# EAGLE design Color Detector RPi Board (EAGLE 9.1.3)
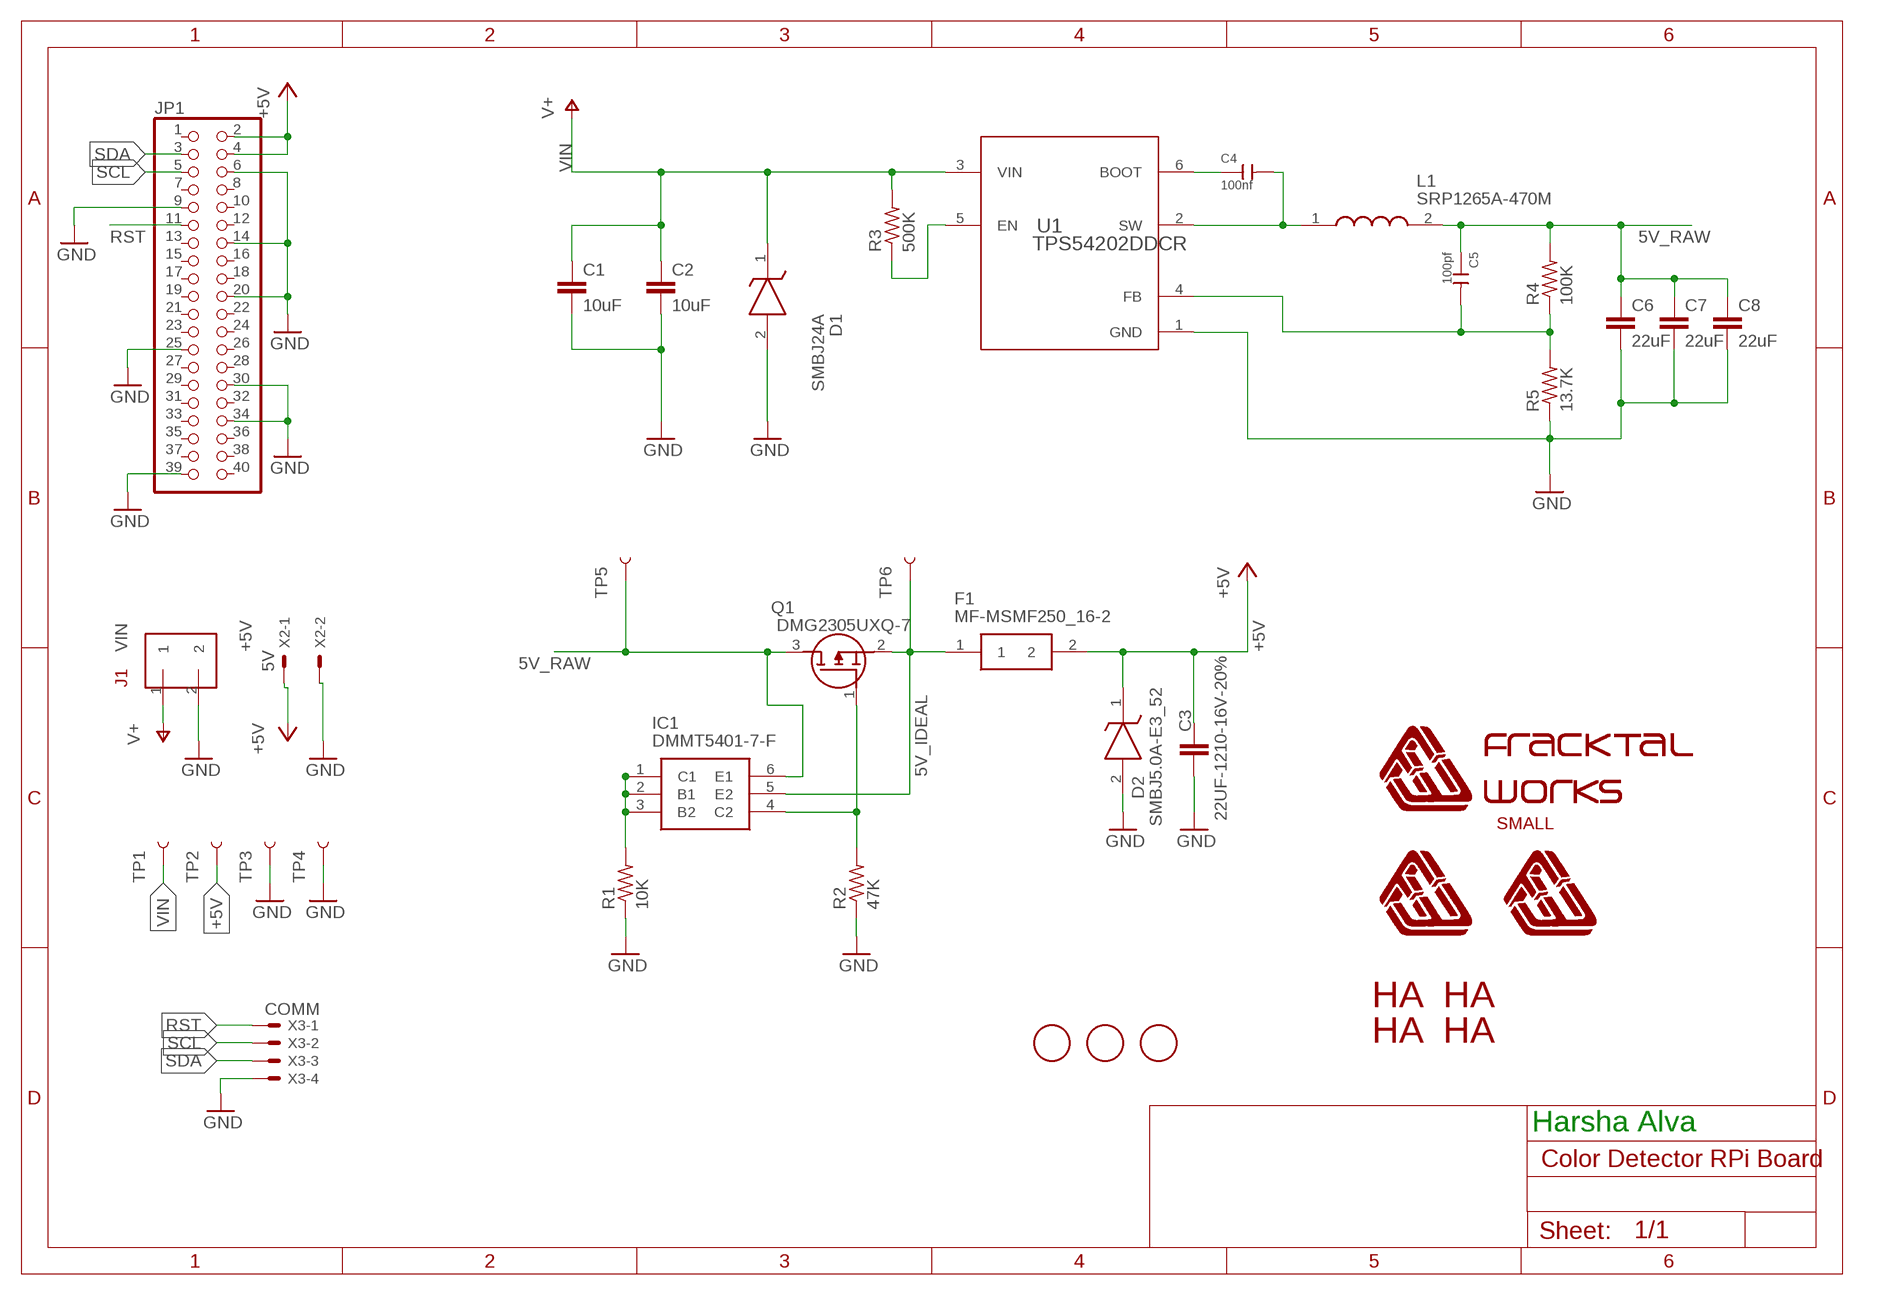
[diagram p0: schematic, sheet 1]

## Parts
$1_39_$_2020-06-29_16-08-13  HA_MARK  [HA_MARK]
$1_40_$_2020-06-29_16-08-1  HA_MARK  [HA_MARK]
$1_40_$_2020-06-29_16-08-13  HA_MARK  [HA_MARK]
C1  10uF  10UF-1210-50V-20%  [1210]
C2  10uF  10UF-1210-50V-20%  [1210]
C3  22UF-1210-16V-20%  [1210]
C4  100nf  CERAMIC-100NF-50V-10%-X7R(0603)  [C0603]
C5  100pf  CERAMIC-100PF-50V-5%-NPO(0603)  [C0603]
C6  22uF  22UF-1210-16V-20%  [1210]
C7  22uF  22UF-1210-16V-20%  [1210]
C8  22uF  22UF-1210-16V-20%  [1210]
D1  SMBJ24A  [DIOM5436X244N]
D2  SMBJ5.0A-E3_52  [DIOM5436X244N]
F1  MF-MSMF250_16-2  [FUSC4632X160N]
FW_TXT_S_2  FWLOGO_TEXT_SMALL  [FWLOGO_TEXT_SMALL]
FWLOGO_1  FWLOGO  [FWLOGO]
FWLOGO_2  FWLOGO  [FWLOGO]
IC1  DMMT5401-7-F  [SOT95P275X110-6N]
J1  TERMINALBLOCK/TOYO/2PIN/5MMPITCH  [TERMINALBLOCK/TOYO/2PIN/5MMPITCH]
JP1  RASPBERRYPI_3B_GPIO  [RASPBERRYPI_3B_GPIO]
L1  SRP1265A-470M  [SRP1265A]
M_HA_1  HA_MARK  [HA_MARK]
Q1  DMG2305UXQ-7  [SOT96P240X110-3N]
R1  10K  R-US_M0805  [M0805]
R2  47K  R-US_M0805  [M0805]
R3  500K  R-US_R0603  [R0603]
R4  100K  R-US_R0603  [R0603]
R5  13.7K  R-US_R0603  [R0603]
TP1  TEST-POINT3X5  [PAD.03X.05]
TP2  TEST-POINT3X5  [PAD.03X.05]
TP3  TEST-POINT3X5  [PAD.03X.05]
TP4  TEST-POINT3X5  [PAD.03X.05]
TP5  TEST-POINT3X5  [PAD.03X.05]
TP6  TEST-POINT3X5  [PAD.03X.05]
U1  TPS54202DDCR  [DDC0006A_N]
U$1  FIDUCIAL  [FIDUCIAL_1MM]
U$2  FIDUCIAL  [FIDUCIAL_1MM]
U$3  FIDUCIAL  [FIDUCIAL_1MM]
X2  5V  JST-XH-02-PIN-LONG-PAD  [JST-XH-02-PACKAGE-LONG-PAD]
X3  COMM  JST-XH-04-PIN-ROUND-PAD  [JST-XH-04-PACKAGE-ROUND-PAD]

## Nets
5V_IDEAL: F1.1 IC1.5(E2) Q1.2(S) TP6.P$1
5V_RAW: C5.1 C6.1 C7.1 C8.1 IC1.6(E1) L1.2 Q1.3(D) R4.2 TP5.P$1
+5V: C3.2 D2.1(K) F1.2 JP1.2 JP1.4 TP2.P$1 X2.1
GND: C1.2 C2.2 C3.1 C6.2 C7.2 C8.2 D1.2(A) D2.2(A) J1.2 JP1.6 JP1.9 JP1.14 JP1.20 JP1.25 JP1.30 JP1.34 JP1.39 R1.1 R2.1 R5.1 TP3.P$1 TP4.P$1 U1.1(GND) X2.2 X3.4
N$1: IC1.4(C2) Q1.1(G) R2.2
N$2: IC1.1(C1) IC1.2(B1) IC1.3(B2) R1.2
N$5: R3.1 U1.5(EN)
N$7: C5.2 R4.1 R5.2 U1.4(FB)
N$18: C4.2 L1.1 U1.2(SW)
N$20: C4.1 U1.6(BOOT)
RST: JP1.11 X3.1
SCL: JP1.5 X3.2
SDA: JP1.3 X3.3
VIN: C1.1 C2.1 D1.1(K) J1.1 R3.2 TP1.P$1 U1.3(VIN) ; supply symbol labelled V+
Unconnected: JP1.1 JP1.7 JP1.8 JP1.10 JP1.12 JP1.13 JP1.15 JP1.16 JP1.17 JP1.18 JP1.19 JP1.21 JP1.22 JP1.23 JP1.24 JP1.26 JP1.27 JP1.28 JP1.29 JP1.31 JP1.32 JP1.33 JP1.35 JP1.36 JP1.37 JP1.38 JP1.40

## Notes on the sheet
- Harsha Alva

## Library data of the parts
$1_39_$_2020-06-29_16-08-13 $1_40_$_2020-06-29_16-08-1 $1_40_$_2020-06-29_16-08-13 M_HA_1 = FracktalWorks:HA_MARK: Maker mark
C1 C2 = SparkFun-Capacitors:10UF: 10.0µF ceramic capacitors A capacitor is a passive two-terminal electrical component used to store electrical energy temporarily in an electric field.; PROD_ID: CAP-09824
C3 C6-C8 = SparkFun-Capacitors:22UF: 22µF ceramic capacitors A capacitor is a passive two-terminal electrical component used to store electrical energy temporarily in an electric field.
C4 = Seeed-Capacitor:CERAMIC-100NF-50V-10%-X7R(0603): 302010138; MPN: CC0603KRX7R9BB104
C5 = Seeed-Capacitor:CERAMIC-100PF-50V-5%-NPO(0603): 302010076; MPN: CC0603JRNPO9BN101
D1 = SamacSys_Parts:SMBJ24A: Bourns SMBJ24A, Uni-Directional TVS Diode, 600W, 2-Pin DO-214AA Source: Datasheet <https://www.bourns.com/docs/Product-Datasheets/SMBJ.pdf>; DESCRIPTION: Bourns SMBJ24A, Uni-Directional TVS Diode, 600W, 2-Pin DO-214AA; HEIGHT: 2.44mm; MANUFACTURER_NAME: Bourns; MANUFACTURER_PART_NUMBER: SMBJ24A; MOUSER_PART_NUMBER: 652-SMBJ24A; MOUSER_PRICE-STOCK: https://www.mouser.co.uk/ProductDetail/Bourns/SMBJ24A?qs=%252Bf8Cd6aE5bw8ORwlx6vP0Q%3D%3D
D2 = SamacSys_Parts:SMBJ5.0A-E3_52: Vishay SMBJ5.0A-E3/52, Uni-Directional TVS Diode, 600W, 2-Pin DO-214AA Source: Datasheet <https://www.vishay.com/docs/88392/smbj.pdf>; ALLIED_NUMBER: 70217303; ALLIED_PRICE-STOCK: https://www.alliedelec.com/generalsemiconductor-vishay-smbj5-0a-e3-52/70217303/; DESCRIPTION: Vishay SMBJ5.0A-E3/52, Uni-Directional TVS Diode, 600W, 2-Pin DO-214AA; HEIGHT: 2.44mm; MANUFACTURER_NAME: Vishay; MANUFACTURER_PART_NUMBER: SMBJ5.0A-E3/52; MOUSER_PART_NUMBER: 625-SMBJ5.0A-E3; MOUSER_PRICE-STOCK: https://www.mouser.com/Search/Refine.aspx?Keyword=625-SMBJ5.0A-E3; RS_PART_NUMBER: 1652507; RS_PRICE-STOCK: http://uk.rs-online.com/web/p/products/1652507
F1 = SamacSys_Parts:MF-MSMF250_16-2: BOURNS - MF-MSMF250/16-2 - FUSE, RESETTABLE PTC, 16V, 2.5A, 1812 Source: Datasheet <https://www.bourns.com/pdfs/mfmsmf.pdf>; DESCRIPTION: BOURNS - MF-MSMF250/16-2 - FUSE, RESETTABLE PTC, 16V, 2.5A, 1812; HEIGHT: 1.6mm; MANUFACTURER_NAME: Bourns; MANUFACTURER_PART_NUMBER: MF-MSMF250/16-2; MOUSER_PART_NUMBER: 652-MF-MSMF250/16-2; MOUSER_PRICE-STOCK: https://www.mouser.com/Search/Refine.aspx?Keyword=652-MF-MSMF250%2F16-2; RS_PART_NUMBER: 6478229P; RS_PRICE-STOCK: http://uk.rs-online.com/web/p/products/6478229P
FW_TXT_S_2 = FracktalWorks:FWLOGO_TEXT_SMALL
FWLOGO_1 FWLOGO_2 = FracktalWorks:FWLOGO: Fracktal Works Logo without name
IC1 = SamacSys_Parts:DMMT5401-7-F: Transistor Dual PNP 150V 0.2A SOT26-6 Diodes Inc DMMT5401-7-F Dual PNP Bipolar Transistor, -200 mA, -150 V, 6-Pin SOT-26 Source: Datasheet; DESCRIPTION: Transistor Dual PNP 150V 0.2A SOT26-6 Diodes Inc DMMT5401-7-F Dual PNP Bipolar Transistor, -200 mA, -150 V, 6-Pin SOT-26; HEIGHT: 1.1mm; MANUFACTURER_NAME: Diodes Inc.; MANUFACTURER_PART_NUMBER: DMMT5401-7-F; MOUSER_PART_NUMBER: 621-DMMT5401-7-F; MOUSER_PRICE-STOCK: https://www.mouser.co.uk/ProductDetail/Diodes-Incorporated/DMMT5401-7-F?qs=hiZRsJxw0h3f7LzTPwvEFQ%3D%3D
J1 = FracktalWorks:TERMINALBLOCK/TOYO/2PIN/5MMPITCH
JP1 = FracktalWorks:RASPBERRYPI_3B_GPIO
L1 = SamacSys_Parts:SRP1265A-470M: Bourns SRP1265A Series Shielded Wire-wound SMD Inductor with a Carbonyl Powder Core, 47 uH 20% 6.5A Idc Source: Datasheet <https://www.bourns.com/docs/Product-Datasheets/SRP1265A.pdf>; DESCRIPTION: Bourns SRP1265A Series Shielded Wire-wound SMD Inductor with a Carbonyl Powder Core, 47 uH 20% 6.5A Idc; HEIGHT: mm; MANUFACTURER_NAME: Bourns; MANUFACTURER_PART_NUMBER: SRP1265A-470M; MOUSER_PART_NUMBER: 652-SRP1265A-470M; MOUSER_PRICE-STOCK: https://www.mouser.com/Search/Refine.aspx?Keyword=652-SRP1265A-470M; RS_PART_NUMBER: 8193513P; RS_PRICE-STOCK: http://uk.rs-online.com/web/p/products/8193513P
Q1 = SamacSys_Parts:DMG2305UXQ-7: MOSFET MOSFET BVDSS Source: Datasheet <https://componentsearchengine.com/Datasheets/1/DMG2305UXQ-7.pdf>; DESCRIPTION: MOSFET MOSFET BVDSS; HEIGHT: 1.1mm; MANUFACTURER_NAME: Diodes Inc.; MANUFACTURER_PART_NUMBER: DMG2305UXQ-7; MOUSER_PART_NUMBER: 621-DMG2305UXQ-7; MOUSER_PRICE-STOCK: https://www.mouser.co.uk/ProductDetail/Diodes-Incorporated/DMG2305UXQ-7?qs=60RJRzIpcl%2FUiAojHt1c9w%3D%3D
R1 R2 = resistor:R-US_: RESISTOR, American symbol
R3-R5 = adafruit:R-US_: RESISTOR, American symbol
TP1-TP6 = SparkFun-Connectors:TEST-POINT: SparkFun Test Points Bare copper test points for troubleshooting or In-Circuit-Testing. These are used by our Production team for verifying production board runs using pogo-pins on test beds. SparkFun Products: SparkFun LSM9DS1 Breakout <https://www.sparkfun.com/products/13284> SparkFun PSOC <https://www.sparkfun.com/products/13714> SparkFun Load Cell Amplifier <https://www.sparkfun.com/products/13879>
U1 = AlainElements:TPS54202DDCR; ALTERNATEPARTNUMBER: TPS54202DDCT; APPLICATION_BUILDNUMBER: *; COMPTYPE: IC; MANUFACTURER: Texas Instruments; MANUFACTURER_NAME: Texas Instruments; MANUFACTURER_PART_NUMBER: TPS54202DDCR; MOUNTTYPE: SMT; PACKAGEREFERENCE: DDC0006A; PARTNUMBER: TPS54202DDCR; PIN_COUNT: 6; REFDES: RefDes; ROHS: Y; TYPE: TYPE; VALUE: Value
U$1-U$3 = adafruit:FIDUCIAL: For use by pick and place machines to calibrate the vision/machine, 1mm By microbuilder.eu
X2 = Rembrandt Electronics - JST XH Connectors v1-0:JST-XH-02-PIN: JST XH Connector 2 Pin Wire to board connector. Pitch: 2,54 mm, (0.100") Number of pins: 2 Created by Rembrandt Electronics www.rembrandtelectronics.com
X3 = Rembrandt:JST-XH-04-PIN: JST XH Connector 2 Pin Wire to board connector. Pitch: 2,54 mm, (0.100") Number of pins: 4 Created by Rembrandt Electronics www.rembrandtelectronics.com

## Board
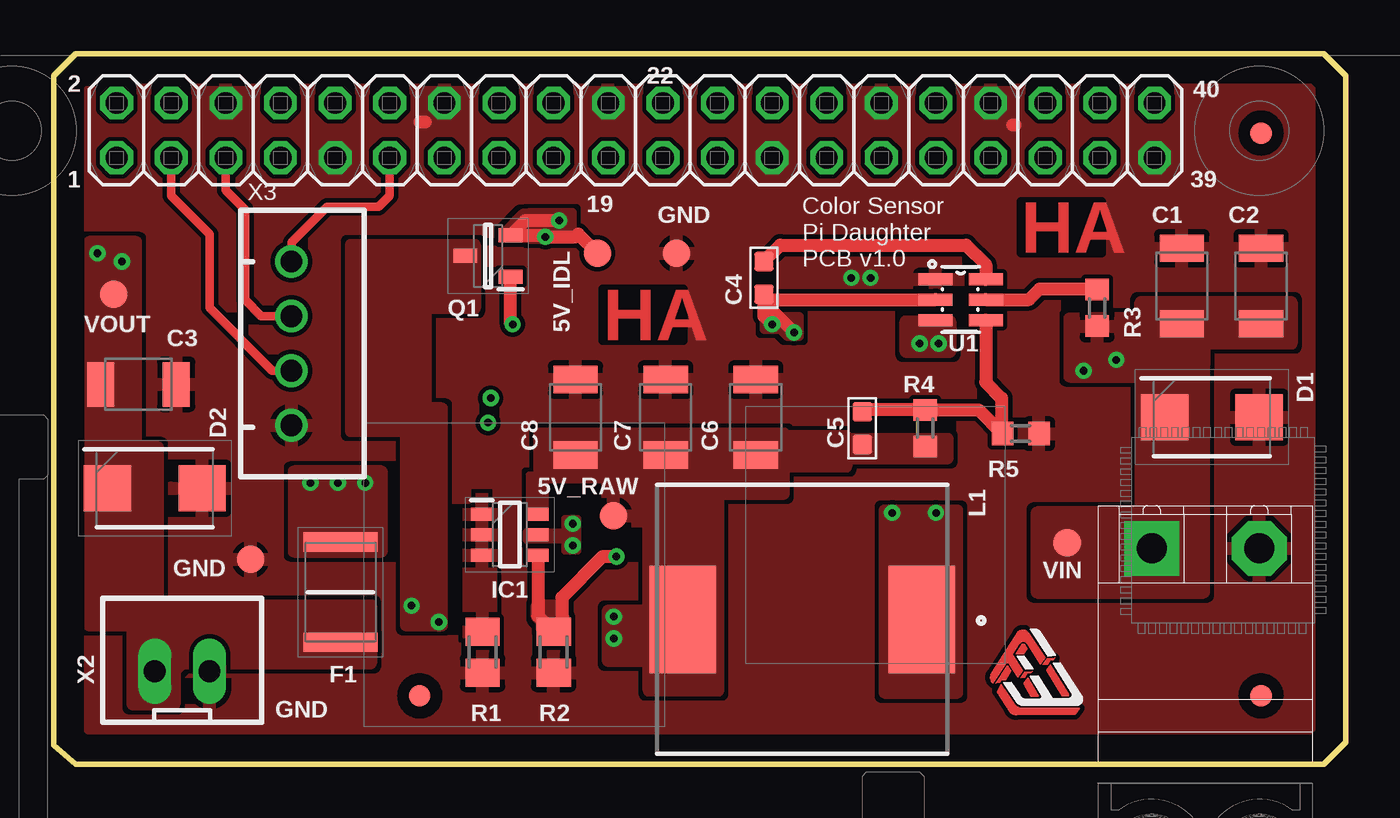
[diagram p1: board, top side]
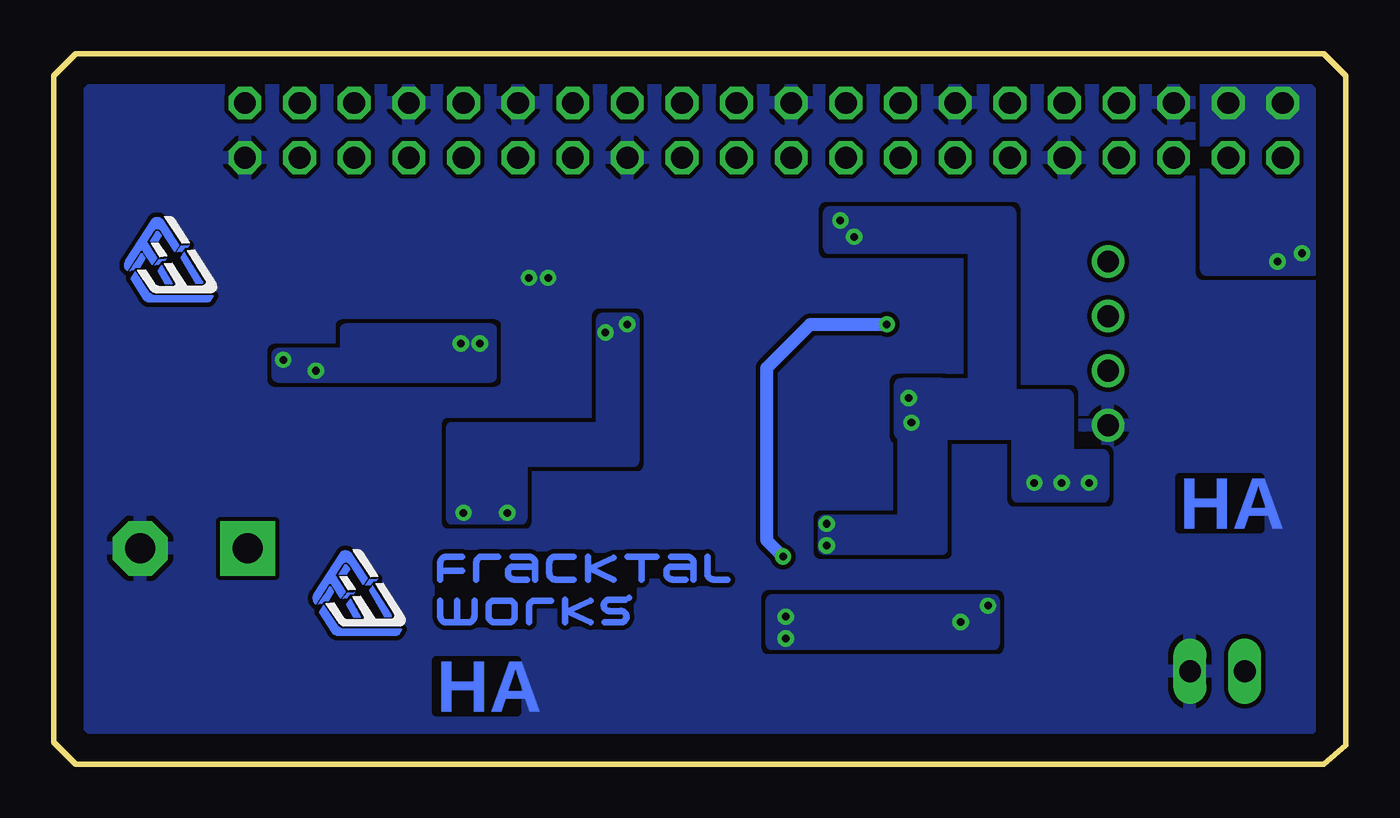
[diagram p2: board, bottom side, seen from below]

Size 60.07 x 33.02 mm. Coordinates in mm from the lower left corner, seen from the top.
Outline: 0,32 0,0.89 1.02,0 59.05,0 60.07,1.02 60.07,32 59.05,33.02 1.02,33.02 0,32
Copper layers (1*16): Top 0.035mm / dielectric 1.5mm / Bottom 0.035mm
Design rules "LionCircuits": minimum track width 8mil, minimum drill 0.35mm, track to track 8mil, track to pad 8mil, pad to pad 8mil, via to via 8mil, smd to smd 8mil, copper to edge 50mil, drill to drill 10mil, minimum pad ring 10mil, minimum via ring 8mil, stop-mask expansion 4mil, vias tented up to drill 0mil, thermal gap 10mil

### Footprints (pad centres in the part's own frame; a part is rotated, then mirrored left to right if it is on the bottom)
1210 = smd 1.27 x 2.06: 1 -1.755,0; 2 1.755,0
C0603 = smd 0.889 x 0.889: 1 0,0.762; 2 0,-0.762
DIOM5436X244N = smd 2.2 x 2.15: 1 -2.2,0; 2 2.2,0
FUSC4632X160N = smd 0.89 x 3.43: 1 -2.325,0; 2 2.325,0
SOT95P275X110-6N = smd 1 x 0.6: 1 -1.3,0.95; 2 -1.3,0; 3 -1.3,-0.95; 4 1.3,-0.95; 5 1.3,0; 6 1.3,0.95
TERMINALBLOCK/TOYO/2PIN/5MMPITCH = drill 1.4 pad 2.54 square: 1 0,0 | drill 1.4 pad 2.54 octagon: 2 5,0
RASPBERRYPI_3B_GPIO = drill 1.016 octagon: 1 -24.13,-1.27; 2 -24.13,1.27; 3 -21.59,-1.27; 4 -21.59,1.27; 5 -19.05,-1.27; 6 -19.05,1.27; 7 -16.51,-1.27; 8 -16.51,1.27; 9 -13.97,-1.27; 10 -13.97,1.27; 11 -11.43,-1.27; 12 -11.43,1.27; 13 -8.89,-1.27; 14 -8.89,1.27; 15 -6.35,-1.27; 16 -6.35,1.27; 17 -3.81,-1.27; 18 -3.81,1.27; 19 -1.27,-1.27; 20 -1.27,1.27; 21 1.27,-1.27; 22 1.27,1.27; 23 3.81,-1.27; 24 3.81,1.27; 25 6.35,-1.27; 26 6.35,1.27; 27 8.89,-1.27; 28 8.89,1.27; 29 11.43,-1.27; 30 11.43,1.27; 31 13.97,-1.27; 32 13.97,1.27; 33 16.51,-1.27; 34 16.51,1.27; 35 19.05,-1.27; 36 19.05,1.27; 37 21.59,-1.27; 38 21.59,1.27; 39 24.13,-1.27; 40 24.13,1.27
SRP1265A = smd 3.1 x 5: 1 -5.55,0; 2 5.55,0
SOT96P240X110-3N = smd 1.1 x 0.65: 1 -1.05,0.96; 2 -1.05,-0.96; 3 1.05,0
M0805 = smd 1.3 x 1.6: 1 -0.95,0; 2 0.95,0
R0603 = smd 1 x 1.1: 1 -0.85,0; 2 0.85,0
PAD.03X.05 = smd 1.27 x 1.27: P$1 0,0
DDC0006A_N = smd 1.575 x 0.559: 1 -1.168,0.95; 2 -1.168,0; 3 -1.168,-0.95; 4 1.168,-0.95; 5 1.168,0; 6 1.168,0.95
FIDUCIAL_1MM = smd 1 x 1: 1 0,0
JST-XH-02-PACKAGE-LONG-PAD = drill 1.016 long: 1 -1.27,0; 2 1.27,0
JST-XH-04-PACKAGE-ROUND-PAD = drill 1.016: 1 -3.81,0; 2 -1.27,0; 3 1.27,0; 4 3.81,0

### Placement (x,y rotation side)
$1_39_$_2020-06-29_16-08-13  42.29,2.41 0 bottom
$1_40_$_2020-06-29_16-08-1  44.96,23.75 0 top
$1_40_$_2020-06-29_16-08-13  7.75,10.92 0 bottom
C1  52.45,22.23 90 top
C2  56.13,22.23 90 top
C3  3.94,17.65 180 top
C4  33.02,22.61 0 top
C5  37.59,15.62 180 top
C6  32.64,16.13 90 top
C7  28.45,16.13 90 top
C8  24.26,16.13 90 top
D1  53.85,16.13 0 top
D2  4.7,12.83 0 top
F1  13.34,8 270 top
FW_TXT_S_2  48.26,4.83 0 bottom
FWLOGO_1  42.04,1.14 0 top
FWLOGO_2  58.29,20.32 0 bottom
IC1  21.21,10.67 0 top
J1  51.05,10.03 0 top
JP1  27.05,29.46 0 top
L1  34.8,6.73 180 top
M_HA_1  25.53,19.69 0 top
Q1  20.19,23.62 180 top
R1  19.94,5.21 90 top
R2  23.24,5.21 90 top
R3  48.51,21.21 270 top
R4  40.51,15.62 270 top
R5  44.96,15.37 180 top
TP1  47.12,10.29 0 top
TP2  2.79,21.84 0 top
TP3  28.96,23.75 0 top
TP4  9.14,9.52 0 top
TP5  26.04,11.56 0 top
TP6  25.27,23.75 0 top
U1  42.16,21.59 0 top
U$1  17.02,3.17 0 top
U$2  56.13,29.34 0 top
U$3  56.13,3.17 0 top
X2  5.97,4.32 0 top
X3  11.05,19.56 270 top

### Tracks (layer width: path | path; a pad name or v marks a point on that pad's centre or on a via)
5V_IDEAL  (via drill 0.35)
  Top 0.61: TP6.P$1 24.38,24.64 24.26,24.51 v22.86,24.51 22.79,24.58 22.1,24.58 Q1.2 21.93,25.27 v23.5,25.27
  other vias: 20.19,15.87 20.32,17.02 11.94,13.08 13.21,13.08 14.48,13.08 24.13,11.18 24.13,10.16
  pour Bottom: 11.3,12.45 15.24,12.45 15.24,15.37 20.7,15.37 20.7,17.65 17.27,17.65 17.27,24 17.4,24 24,24 24,25.65 15.62,25.65 15.62,17.14 12.95,17.14 12.95,14.35 11.3,14.35
  pour Top (no thermals): 11.18,9.91 15.24,9.91 15.24,13.59 11.18,13.59
  pour Bottom: 24.26,11.3 24.26,10.03 18.8,10.03 18.8,17.65 20.57,17.65 20.57,11.3
  pour Top (no thermals): 21.97,10.79 23.75,10.79 23.75,11.43 24.38,11.43 24.38,9.91 23.75,9.91 23.75,10.41 21.97,10.41
  pour Top: 22.1,25.65 24.13,25.65 24.13,24.38 22.1,24.38
  pour Top (no thermals): 22.23,24.51 20.95,24.51 20.95,24.64 21.84,25.53 22.23,25.53
5V_RAW  (via drill 0.35)
  other vias: 26.04,6.86 26.04,5.84 16.64,7.37 17.91,6.6
  pour Top (no thermals): 22.61,15.37 33.91,15.37 33.91,12.57 30.86,12.57 30.86,3.43 27.69,3.43 27.69,13.33 22.61,13.33
  pour Top (no thermals): 19.56,24.13 19.56,21.21 17.27,21.21 17.27,15.49 13.84,15.49 13.84,24.13
  pour Top: 16.38,16.51 16.38,6.48 18.03,6.48 18.03,16.51
  pour Bottom: 26.67,7.62 16.38,7.62 16.38,5.59 26.67,5.59
  pour Top: 25.78,7.11 25.78,4.83 28.19,4.83 28.19,7.11
  pour Top (no thermals): 22.1,13.46 22.1,11.56 22.86,11.56 22.86,13.46
  pour Top (no thermals): 36.7,15.11 41.53,15.11 41.53,14.22 36.7,14.22
  pour Top (no thermals): 33.15,15.24 36.83,15.24 36.83,13.84 33.15,13.84
  pour Top: 25.78,11.3 25.78,13.33 27.56,13.33 27.56,11.3
+5V  (via drill 0.35)
  other vias: 2.03,23.75 3.17,23.37
  pour Bottom (no thermals): 1.52,32.13 1.52,22.99 6.48,22.99 6.48,32.13
  pour Top (no thermals): 1.65,24.26 1.65,6.48 4.83,6.48 4.83,14.73 3.81,14.73 3.81,24.26
  pour Top (no thermals): 14.73,7.37 14.73,4.7 5.97,4.7 5.59,4.32 5.59,2.79 3.68,2.79 3.68,6.48 4.57,7.37
GND  (via drill 0.35)
  Top 0.61: 17.27,29.85 17.02,29.85 | 44.58,29.72 44.7,29.72
  other vias: 37.08,22.61 37.97,22.61
  pour Bottom (rank 2): 0,34.29 61.09,34.29 61.09,-0.89 0.13,-0.76 0,-0.89
  pour Top (rank 2): -0.25,35.43 62.23,35.43 62.23,35.05 62.23,-2.03 -0.25,-2.03
  pour Top (rank 2, no thermals): 42.29,31.37 42.29,29.46 44.83,29.46 44.83,31.37
  pour Top (no thermals): 37.21,31.37 37.21,29.46 39.75,29.46 39.75,31.37
  pour Top (rank 2, no thermals): 49.91,29.08 49.91,27.18 52.45,27.18 52.45,29.08
  pour Top (no thermals): 32.13,29.08 32.13,27.18 34.67,27.18 34.67,29.08
  pour Top (no thermals): 11.81,29.08 11.81,27.18 14.35,27.18 14.35,29.08
  pour Top (no thermals): 24.51,31.37 24.51,29.46 27.05,29.46 27.05,31.37
  pour Top (no thermals): 16.89,31.37 16.89,29.46 19.43,29.46 19.43,31.37
  pour Top (no thermals): 6.73,31.37 6.73,29.46 9.27,29.46 9.27,31.37
N$1  (via drill 0.35)
  Top 0.61: Q1.1 21.24,20.45 v21.34,20.45 | v26.16,9.65 25.53,9.65 23.62,7.75 23.62,6.54 R2.2 22.51,6.89 IC1.4
  Bottom 0.61: v21.34,20.45 24.89,20.45 26.92,18.42 26.92,10.41 v26.16,9.65
  pour Top (no thermals): 22.48,7.37 23.62,7.37 23.62,6.86 23.75,6.73 23.75,6.22 22.73,6.22 22.73,6.6 22.48,6.86
N$2
  pour Top: 19.3,12.32 20.32,12.32 20.32,5.97 19.3,5.97
N$5
  Top 0.61: R3.1 48.48,22.1 45.85,22.1 45.34,21.59 U1.5
N$7
  Top 0.61: U1.4 43.33,17.76 44.07,17.02 44.07,15.41 R5.2 43,16.47 42.67,16.47 42.55,16.47 R4.1 37.68,16.47 C5.2
N$18  (via drill 0.35)
  Top 0.61: C4.2 33.27,21.59 U1.2 | v33.4,20.45 33.02,20.83 C4.2 | v34.42,20.07 33.02,21.46 C4.2
  other vias: 38.99,11.68 41.02,11.68
  pour Top (no thermals): 42.04,11.81 38.61,11.81 38.61,3.3 42.04,3.3
  pour Bottom: 33.15,20.7 33.15,14.1 38.35,14.1 38.35,11.43 41.53,11.43 41.53,15.62 34.54,15.62 34.54,20.7
  pour Top: 33.02,20.83 34.67,20.83 34.67,19.86 34.11,19.86 33.78,20.19 33.02,20.19
N$20
  Top 0.61: U1.6 43.33,23.22 42.42,24.13 33.78,24.13 C4.1
RST
  Top 0.406: X3.1 11.05,24.26 12.7,25.91 15.11,25.91 15.62,26.42 JP1.11
SCL
  Top 0.406: X3.2 9.65,20.83 8.89,21.59 8.89,25.78 8,26.67 JP1.5
SDA
  Top 0.406: JP1.3 5.46,26.42 7.24,24.64 7.24,21.21 10.16,18.29 X3.3
VIN  (via drill 0.35)
  other vias: 41.15,19.56 47.88,18.29 40.26,19.56 49.4,18.8
  pour Top (no thermals): 45.72,8 53.47,8 53.47,18.8 50.55,18.8 50.55,11.68 45.72,11.68
  pour Top (no thermals): 50.55,18.54 50.55,21.46 57.53,21.46 57.53,19.56 53.47,19.56 53.47,18.54
  pour Top: 47.24,20.7 47.24,18.03 51.05,18.03 51.05,20.57 50.93,20.7
  pour Bottom: 39.75,20.19 46.48,20.19 46.48,19.05 49.66,19.05 49.66,18.03 44.58,18.03 39.75,18.03
  pour Top (no thermals): 39.62,20.57 41.66,20.57 41.66,19.18 39.62,19.18

### Text on the board
tPlace: Color Sensor / Pi Daughter / PCB v1.0
tNames: 22 | 2 | 40 | 1 | 39 | 19 | GND | VOUT | 5V_IDL | 5V_RAW | GND | VIN | GND